# Altium schematic sheet SlimRx.SchDoc
size A; SheetNumber: 2; SheetTotal: 3
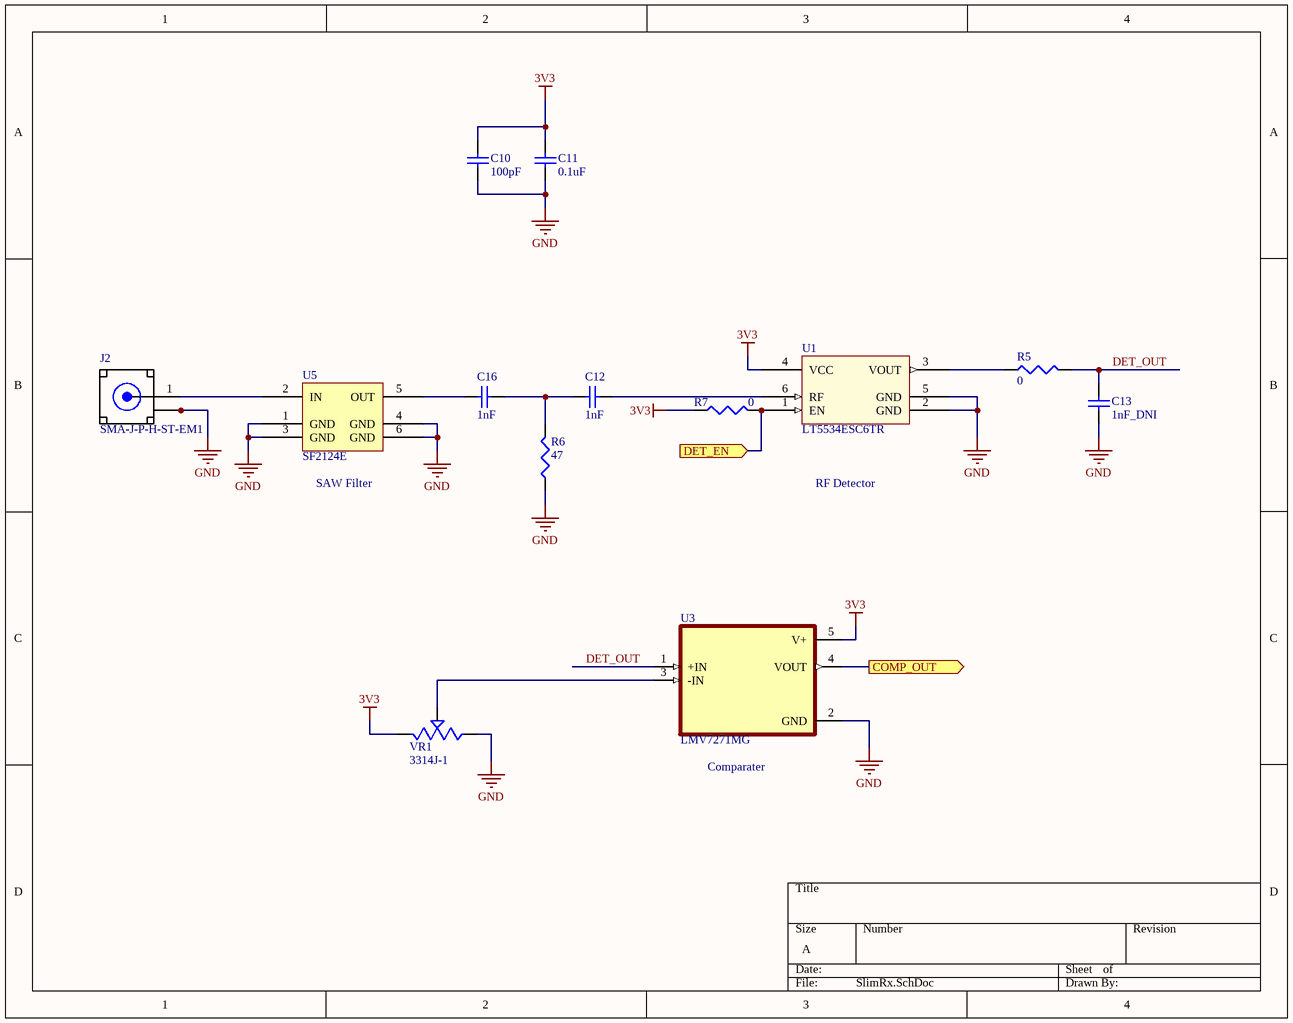
[diagram p0: SlimRx.SchDoc]

## Parts
C10  100pF  [SMD-0603]
C11  0.1uF  [SMD-0805]
C12  1nF  [SMD-0603]
C13  1nF_DNI  [SMD-0603]
C16  1nF  [SMD-0603]
J2  SMA-J-P-H-ST-EM1  [SMA-J-P-H-ST-EM1]
R5  0  [SMD-0603]
R6  47  [SMD-0603]
R7  0  [SMD-0603]
U1  LT5534ESC6TR  [SOT-6_SC]
U3  LMV7271MG  [SOT65P210X110-5N]
U5  SF2124E  [FIL_SF2124E]
VR1  3314J-1  [TRIM_3314J-1]

## Ports
COMP_OUT (out), DET_EN (in)

## Nets
3V3: C10.2 C11.2 R7.1 U1.4(VCC) U3.5(V+) VR1.1(CCW)
GND: C10.1 C11.1 C13.1 J2.2_1(GND) J2.2_2(GND) J2.3_1(GND) J2.3_2(GND) R6.1 U1.2(GND) U1.5(GND) U3.2(GND) U5.1(GND) U5.3(GND) U5.4(GND) U5.6(GND) VR1.3(CW)
COMP_OUT: U3.4(VOUT) ; port COMP_OUT
DET_EN: R7.2 U1.1(EN) ; port DET_EN
DET_OUT: C13.2 R5.2 U3.1(+IN)
NetC12_1: C12.1 C16.2 R6.2
NetC12_2: C12.2 U1.6(RF)
NetC16_1: C16.1 U5.5(OUT)
NetJ2_1: J2.1(SIGNAL) U5.2(IN)
NetR5_1: R5.1 U1.3(VOUT)
NetU3_3: U3.3(-IN) VR1.2(WIPER)

## Notes on the sheet
- (near U5) SAW Filter
- RF Detector
- (near U3) Comparater

## Library data of the parts
C10 C12 C13 C16 = CAP0603: Ceramic Capacitor 0603
C11 = CAP0805: Ceramic Capacitor 0805 Imperial (2012 Metric)
J2 = SMA-J-P-H-ST-EM1: Connector SMA F 50Ohm Solder ST Edge Mount Gold Over Nickel Tray; MF: Samtec; Price: None; SnapEDA_Link: https://www.snapeda.com/parts/SMA-J-P-H-ST-EM1/Samtec%20Inc./view-part/?ref=snap; MP: SMA-J-P-H-ST-EM1; Package: None; Availability: Unavailable; Value: *
R5-R7 = RES0603: Resistor-0603
U5 = SF2124E: Signal Conditioning FILTER, SAW, 2441.8 MHZ, 6SMD
VR1 = 3314J-1: 10 kOhms 0.25W, 1/4W J Lead Surface Mount Trimmer Potentiometer Cermet 1 Turn Top Adjustment; MP: 3314J-1-103E; MF: Bourns; Availability: Good; Package: DFN-8 Bourns; SnapEDA_Link: https://www.snapeda.com/parts/3314J-1-103E/Bourns/view-part/485632/?ref=snap; Purchase-URL: https://pricing.snapeda.com/search/part/3314J-1-103E/?ref=eda; Value: *; Check_prices: https://www.snapeda.com/parts/3314J-1-103E/Bourns/view-part/485632/?ref=eda; Price: None
U1 = LT5534ESC6TR: Package: None; Price: None; Value: *; MP: LT5534ESC6TR; Availability: Unavailable
U3 = LMV7271MG: Package: None; Price: None; Value: *; MP: LMV7271MG; Availability: Unavailable